# EAGLE schematic axoloti_sliders (EAGLE 7.4.0)
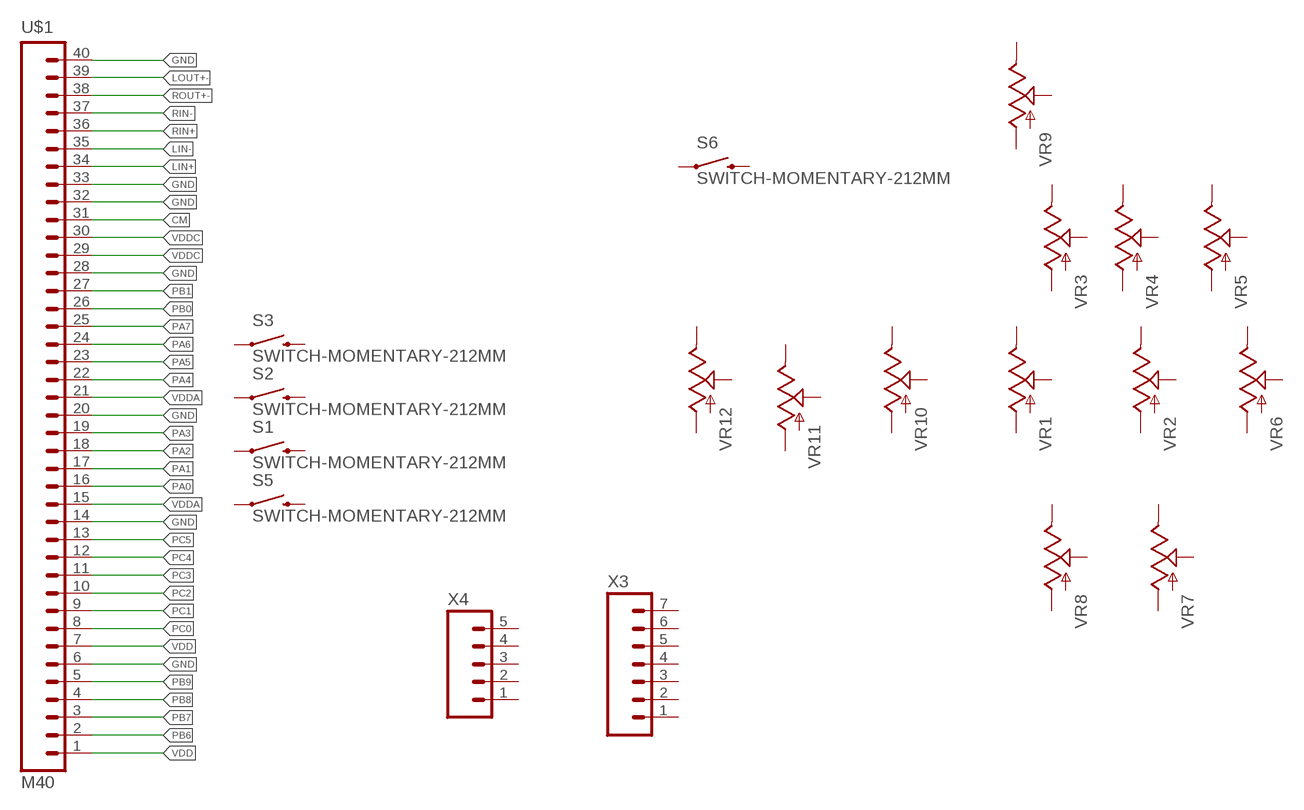
[diagram p0: schematic, sheet 1]

## Parts
S1  SWITCH-MOMENTARY-212MM  [TACTILE-PTH-12MM]
S2  SWITCH-MOMENTARY-212MM  [TACTILE-PTH-12MM]
S3  SWITCH-MOMENTARY-212MM  [TACTILE-PTH-12MM]
S5  SWITCH-MOMENTARY-212MM  [TACTILE-PTH-12MM]
S6  SWITCH-MOMENTARY-212MM  [TACTILE-PTH-12MM]
U$1  M40  [1X40]
VR1  SLIDER20MM  [SLIDER-SMALL]
VR2  SLIDER20MM  [SLIDER-SMALL]
VR3  SLIDER20MM  [SLIDER-SMALL]
VR4  SLIDER20MM  [SLIDER-SMALL]
VR5  SLIDER20MM  [SLIDER-SMALL]
VR6  SLIDER20MM  [SLIDER-SMALL]
VR7  SLIDER20MM  [SLIDER-SMALL]
VR8  SLIDER20MM  [SLIDER-SMALL]
VR9  SLIDER20MM  [SLIDER-SMALL]
VR10  SLIDER20MM  [SLIDER-SMALL]
VR11  SLIDER20MM  [SLIDER-SMALL]
VR12  SLIDER20MM  [SLIDER-SMALL]
X3  M07LOCK  [1X07_LOCK]
X4  M05LOCK  [1X05_LOCK]

## Nets
CM: U$1.31
GND: U$1.6 U$1.14 U$1.20 U$1.28 U$1.32 U$1.33 U$1.40
LIN+: U$1.34
LIN-: U$1.35
LOUT+-: U$1.39
PA0: U$1.16
PA1: U$1.17
PA2: U$1.18
PA3: U$1.19
PA4: U$1.22
PA5: U$1.23
PA6: U$1.24
PA7: U$1.25
PB0: U$1.26
PB1: U$1.27
PB6: U$1.2
PB7: U$1.3
PB8: U$1.4
PB9: U$1.5
PC0: U$1.8
PC1: U$1.9
PC2: U$1.10
PC3: U$1.11
PC4: U$1.12
PC5: U$1.13
RIN+: U$1.36
RIN-: U$1.37
ROUT+-: U$1.38
VDD: U$1.1 U$1.7
VDDA: U$1.15 U$1.21
VDDC: U$1.29 U$1.30
Unconnected: S1.1 S1.3 S2.1 S2.3 S3.1 S3.3 S5.1 S5.3 S6.1 S6.3 VR1.BOTTOM(A) VR1.TOP(E) VR1.WIPER(S) VR2.BOTTOM(A) VR2.TOP(E) VR2.WIPER(S) VR3.BOTTOM(A) VR3.TOP(E) VR3.WIPER(S) VR4.BOTTOM(A) VR4.TOP(E) VR4.WIPER(S) VR5.BOTTOM(A) VR5.TOP(E) VR5.WIPER(S) VR6.BOTTOM(A) VR6.TOP(E) VR6.WIPER(S) VR7.BOTTOM(A) VR7.TOP(E) VR7.WIPER(S) VR8.BOTTOM(A) VR8.TOP(E) VR8.WIPER(S) VR9.BOTTOM(A) VR9.TOP(E) VR9.WIPER(S) VR10.BOTTOM(A) VR10.TOP(E) VR10.WIPER(S) VR11.BOTTOM(A) VR11.TOP(E) VR11.WIPER(S) VR12.BOTTOM(A) VR12.TOP(E) VR12.WIPER(S) X3.1 X3.2 X3.3 X3.4 X3.5 X3.6 X3.7 X4.1 X4.2 X4.3 X4.4 X4.5

## Library data of the parts
S1-S3 S5 S6 = SparkFun-Electromechanical:SWITCH-MOMENTARY-2: Various NO switches- pushbuttons, reed, etc; PROD_ID: SWCH-09185
U$1 = SparkFun-Connectors:M40: 1x40 .1" header
VR1-VR12 = SparkFun-Electromechanical:SLIDER: Slide-type potentiometers. Small and meduim footprints untested.; PROD_ID: COM-11620
X3 = SparkFun-Connectors:M07: Header 7 Standard 7-pin 0.1" header. Use with straight break away headers (SKU : PRT-00116), right angle break away headers (PRT-00553), swiss pins (PRT-00743), machine pins (PRT-00117), and female headers (PRT-00115). NOTES ON THE VARIANTS LOCK and LOCK_LONGPADS... This footprint was designed to help hold the alignment of a through-hole component (i.e. 7-pin header) while soldering it into place. You may notice that each hole has been shifted either up or down by 0.005 of an inch from it's more standard position (which is usually a perfectly straight line). This slight alteration caused the pins (the squares in the middle) to touch the edges of the holes. Because they are alternating, it causes a "brace" to hold the header in place. 0.005 has proven to be the perfect amount of "off-center" position when using our standard breakaway headers. Although looks a little odd when you look at the bare footprint, once you have a header in there, the alteration is very hard to notice. Also, if you push a header all the way into place, it is covered up entirely on the bottom side. This idea of altering the position of holes to aid alignment will be further integrated into the Sparkfun Library for other footprints. It can help hold any component with 3 or more connection pins.
X4 = SparkFun-Connectors:M05: Header 5 Standard 5-pin 0.1" header. Use with straight break away headers (SKU : PRT-00116), right angle break away headers (PRT-00553), swiss pins (PRT-00743), machine pins (PRT-00117), and female headers (PRT-00115). Molex polarized connector foot print use with SKU : PRT-08230 with associated crimp pins and housings.